# EAGLE design fingerprint_2te (EAGLE 5.04)
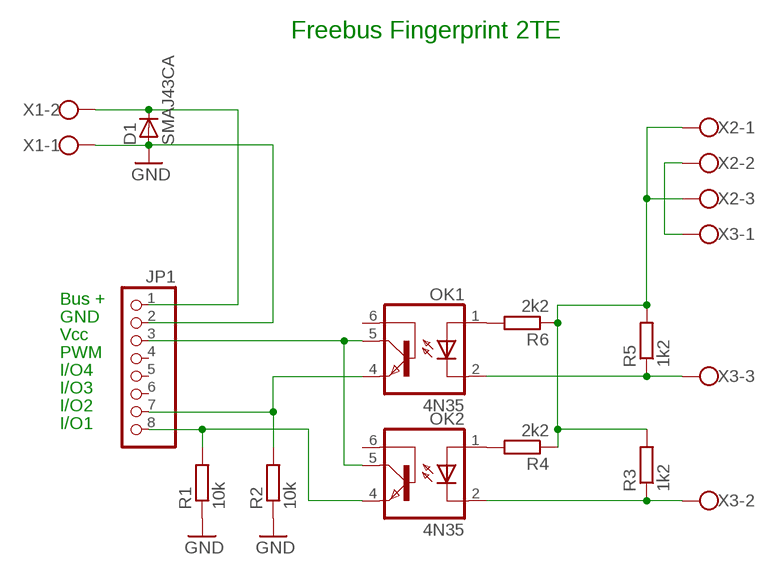
[diagram p0: schematic, sheet 1]

## Parts
D1  SMAJ43CA  D-  [SMA]
JP1  PINHD-1X8  [1X08]
OK1  4N35  [DIL06]
OK2  4N35  [DIL06]
R1  10k  R-EU_0207/10  [0207/10]
R2  10k  R-EU_0207/10  [0207/10]
R3  1k2  R-EU_0207/10  [0207/10]
R4  2k2  R-EU_0207/10  [0207/10]
R5  1k2  R-EU_0207/10  [0207/10]
R6  2k2  R-EU_0207/10  [0207/10]
X1  W237-02P  [W237-132]
X2  W237-3E  [W237-3E]
X3  W237-3E  [W237-3E]

## Nets
GND: D1.2(A) JP1.2 R1.1 R2.1 X1.1
N$1: JP1.8 OK2.4(EMI) R1.2
N$2: JP1.7 OK1.4(EMI) R2.2
N$3: JP1.3 OK1.5(COL) OK2.5(COL)
N$4: D1.1(C) JP1.1 X1.2
N$5: OK2.1(A) R4.2
N$6: R3.2 R4.1 R5.2 R6.1 X2.1 X2.3
N$7: X2.2 X3.1
N$8: OK2.2(C) R3.1 X3.2
N$9: OK1.2(C) R5.1 X3.3
N$10: OK1.1(A) R6.2
Unconnected: JP1.4 JP1.5 JP1.6 OK1.6(BAS) OK2.6(BAS)

## Notes on the sheet
- Freebus Fingerprint 2TE
- Bus +
- GND
- Vcc
- PWM
- I/O4
- I/O3
- I/O2
- I/O1

## Library data of the parts
D1 = semicon-smd-ipc:D-: DIODE unfilled
JP1 = pinhead:PINHD-1X8: PIN HEADER
OK1 OK2 = optocoupler:4N35: MOTOROLA OPTO COUPLER
R1-R6 = rcl:R-EU_: RESISTOR, European symbol
X1 = con-wago-508:W237-02P: WAGO SREW CLAMP
X2 X3 = con-wago-508:W237-3E: WAGO SREW CLAMP

## Board
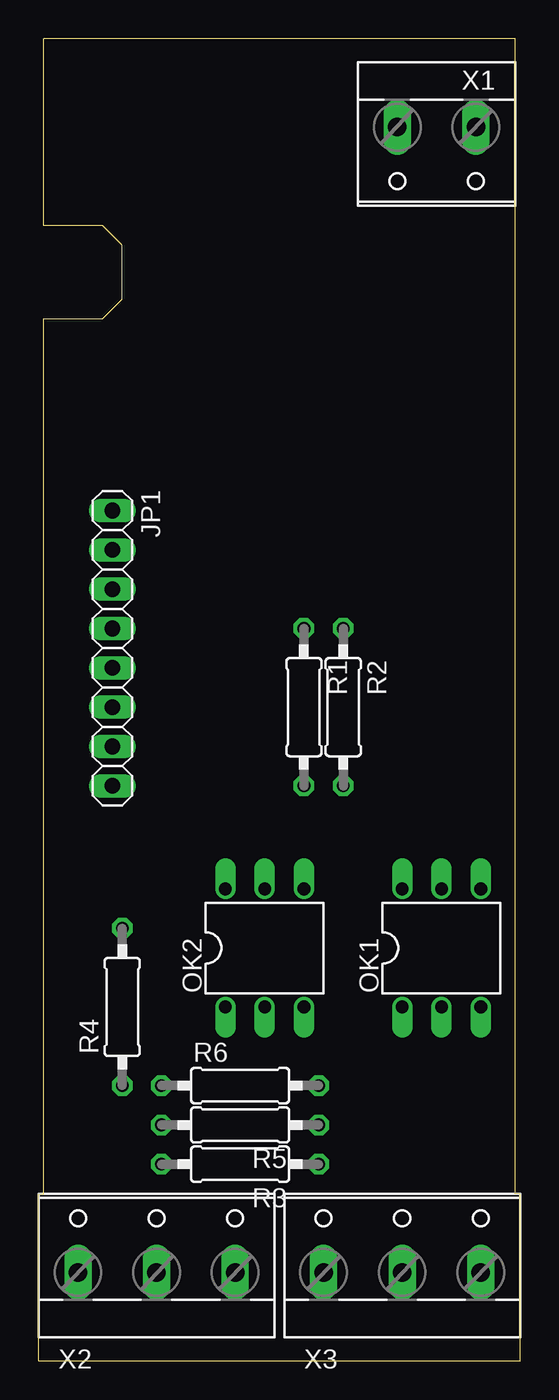
[diagram p1: board, top side]
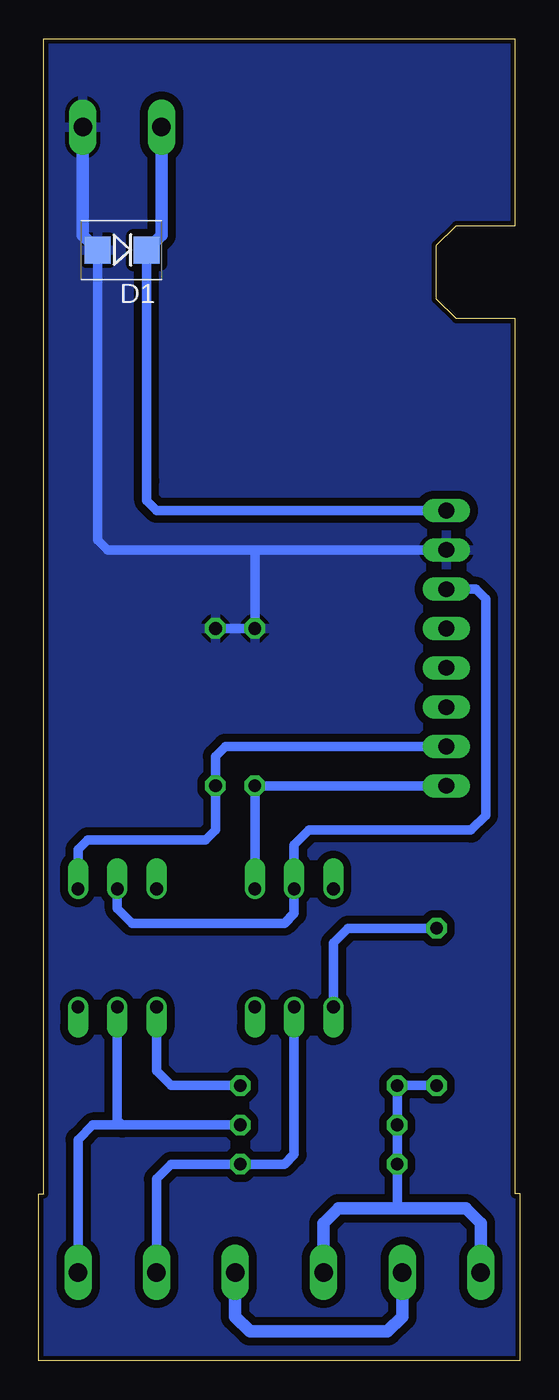
[diagram p2: board, bottom side, seen from below]

Size 31.11 x 85.41 mm. Coordinates in mm from the lower left corner, seen from the top.
Outline: 0,0 0,10.79 0.32,10.79 0.32,67.31 4.13,67.31 5.4,68.58 5.4,72.07 4.13,73.34 0.32,73.34 0.32,85.41 30.8,85.41 30.8,10.79 31.11,10.79 31.11,0 0,0
Copper layers (1*16): Top 0.035mm / dielectric 1.5mm / Bottom 0.035mm
Design rules "default *": minimum track width 10mil, minimum drill 24mil, track to track 20mil, track to pad 20mil, pad to pad 12mil, via to via 12mil, smd to smd 8mil, copper to edge 12mil, drill to drill 8mil, minimum pad ring 10mil, minimum via ring 8mil, stop-mask expansion 4mil, vias tented up to drill 0mil, thermal gap 10mil

### Footprints (pad centres in the part's own frame; a part is rotated, then mirrored left to right if it is on the bottom)
SMA = smd 1.67 x 1.73: 1 -1.576,0; 2 1.58,0.014
1X08 = drill 1.016 long: 1 -8.89,0; 2 -6.35,0; 3 -3.81,0; 4 -1.27,0; 5 1.27,0; 6 3.81,0; 7 6.35,0; 8 8.89,0
DIL06 = drill 0.813 offset: 1 -2.54,-3.81; 2 0,-3.81; 3 2.54,-3.81; 4 2.54,3.81; 5 0,3.81; 6 -2.54,3.81
0207/10 = drill 0.813 octagon: 1 -5.08,0; 2 5.08,0
W237-132 = drill 1.194 long: 1 -2.54,-0.635; 2 2.54,-0.635
W237-3E = drill 1.194 long: 1 -5.08,-0.635; 2 0,-0.635; 3 5.08,-0.635

### Placement (x,y rotation side)
D1  25.72,71.75 180 bottom
JP1  4.76,46.04 270 top
OK1  26.04,26.67 0 top
OK2  14.61,26.67 0 top
R1  17.14,42.23 270 top
R2  19.68,42.23 270 top
R3  13.02,12.7 180 top
R4  5.4,22.86 90 top
R5  13.02,15.24 180 top
R6  13.02,17.78 0 top
X1  25.72,79.06 180 top
X2  7.62,6.35 0 top
X3  23.49,6.35 0 top

### Tracks (layer width: path | path; a pad name or v marks a point on that pad's centre or on a via)
GND
  Bottom 0.61: D1.2 27.3,57.16 27.31,57.15 27.31,53.02 26.67,52.39 17.15,52.39 | JP1.2 17.15,52.39 | R2.1 R1.1 17.15,52.39
  Bottom 0.813: X1.1 28.26,72.7 D1.2
  pour Bottom: 0.32,85.41 30.8,85.41 30.8,0.32 31.11,0 0.32,0
N$1
  Bottom 0.61: JP1.8 R1.2 | R1.2 16.51,37.15 | R1.2 OK2.4
N$2
  Bottom 0.61: JP1.7 19.05,39.69 19.68,39.05 R2.2 19.68,34.29 20.32,33.66 27.94,33.66 28.58,33.02 OK1.4
N$3
  Bottom 0.61: OK1.5 26.04,29.21 25.08,28.26 15.24,28.26 14.6,28.89 OK2.5 14.6,33.34 13.65,34.29 3.17,34.29 2.22,35.24 2.22,49.21 2.86,49.85 JP1.3
N$4
  Bottom 0.61: JP1.1 20.32,54.93 23.49,54.93 24.13,55.56 24.13,56.83 24.14,56.84 D1.1
  Bottom 0.813: X1.2 23.18,72.72 D1.1
N$5
  Bottom 0.61: OK2.1 12.07,26.99 11.11,27.94 R4.2
N$6
  Bottom 0.61: 7.62,9.84 7.94,10.16 R3.2 R5.2 R6.1 R4.1
  Bottom 0.813: X2.1 2.54,8.89 3.49,9.84 7.62,9.84 11.75,9.84 12.7,8.89 X2.3
N$7
  Bottom 0.813: X3.1 18.42,2.86 17.46,1.91 8.57,1.91 7.62,2.86 X2.2
N$8
  Bottom 0.61: X3.2 23.49,11.75 22.54,12.7 R3.1 15.24,12.7 14.6,13.34 OK2.2
N$9
  Bottom 0.61: R5.1 25.72,15.24 | 25.72,15.24 27.62,15.24 28.58,14.29 X3.3 | OK1.2 26.04,15.56 25.72,15.24
N$10
  Bottom 0.61: R6.2 22.54,17.78 23.49,18.73 OK1.1